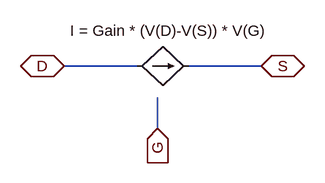
[diagram p0: schematic pionch.asc]
pionch.asc, the LTspice schematic file:
Version 4
SHEET 1 880 680
WIRE 128 112 16 112
WIRE 320 112 208 112
WIRE 160 208 160 160
FLAG 16 112 D
IOPIN 16 112 BiDir
FLAG 160 208 G
IOPIN 160 208 In
FLAG 320 112 S
IOPIN 320 112 BiDir
SYMBOL bi2 208 112 R90
WINDOW 0 -79 45 Invisible 2
WINDOW 3 -70 31 VTop 2
SYMATTR InstName B1
SYMATTR Value I = Gain * (V(D)-V(S)) * V(G)

The netlist it stands for:
* pionch.asc
B1 D S I = Gain * (V(D)-V(S)) * V(G)
.backanno
.end